# Altium schematic sheet APP_1_DriveMoteur_m.SchDoc
size Tabloid; SheetNumber: 8; SheetTotal: 15; Sheet_Name: DriveMoteur; Size: 11x17
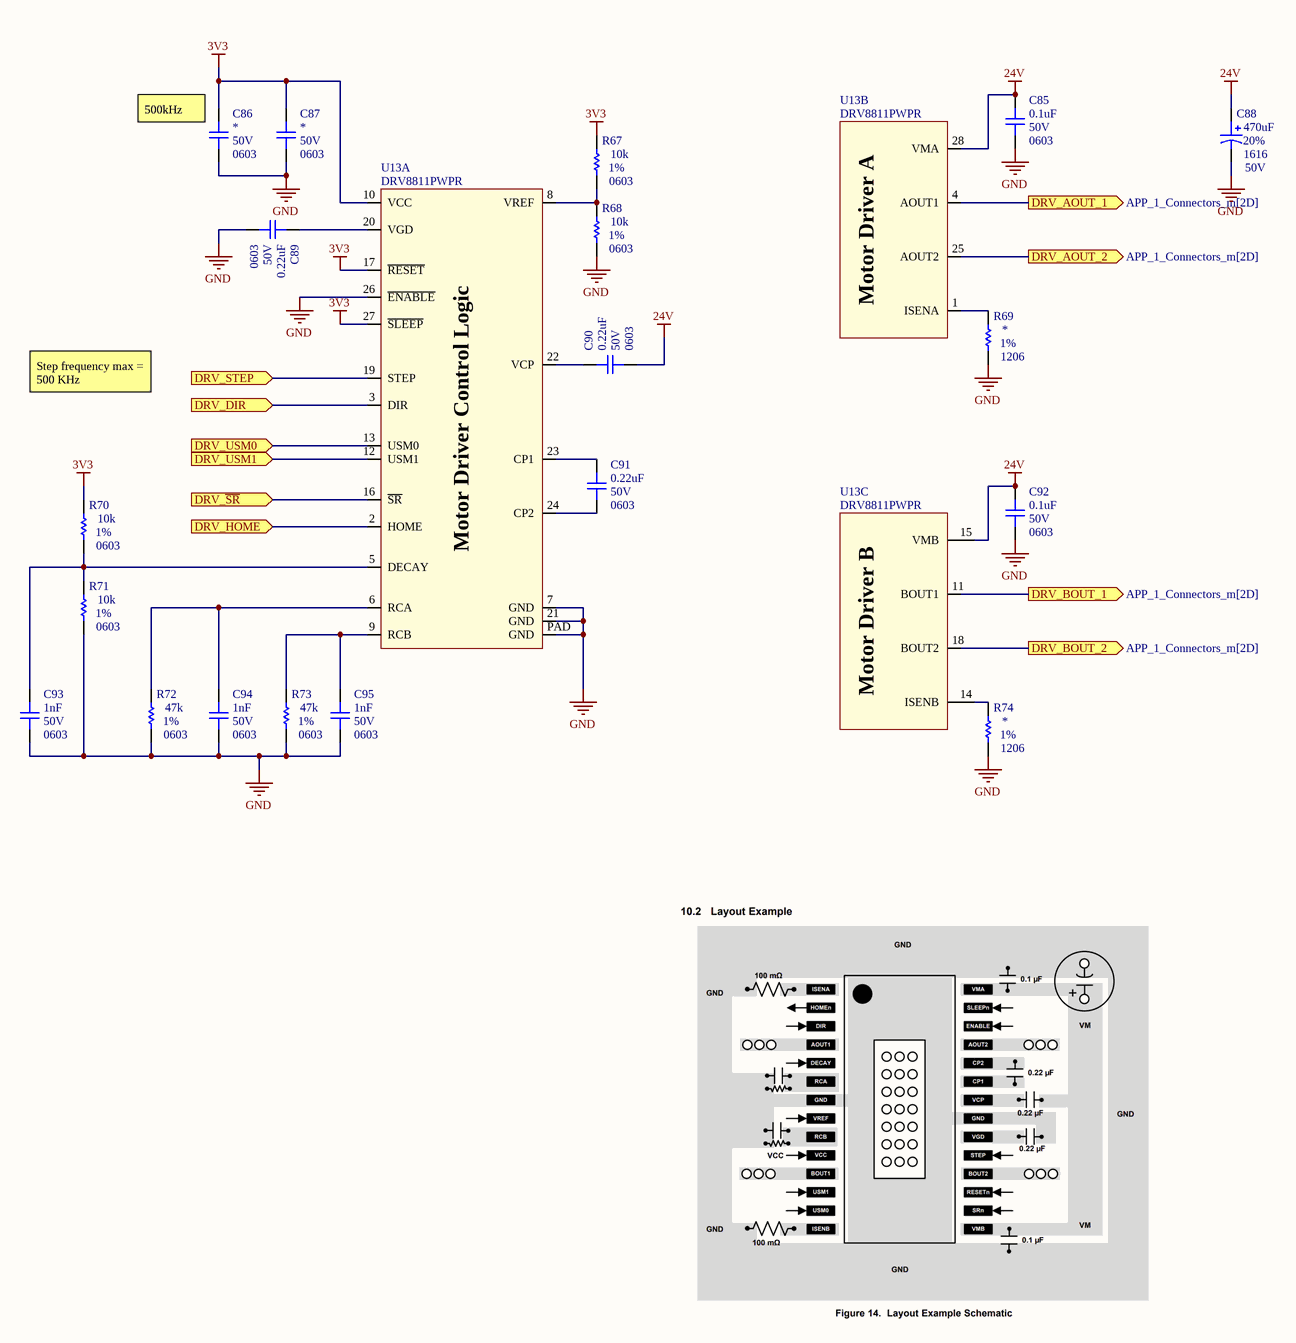
[diagram p0: APP_1_DriveMoteur_m.SchDoc]

## Parts
C85  value 0.1uF  Voltage: 50V  Package: 0603  [CAP_0603]  (hidden comment: CAP - 0603)
C86  Voltage: 50V  Package: 0603  [CAP_0603]  (hidden comment: CAP - 0603)
C87  Voltage: 50V  Package: 0603  [CAP_0603]  (hidden comment: CAP - 0603)
C88  value 470uF  Voltage: 50V  Package: 1616  Precision: 20%  [CAP_ALU_1616_vishay]  (hidden comment: MAL214699108E3)
C89  value 0.22uF  Voltage: 50V  Package: 0603  [CAP_0603]  (hidden comment: CAP - 0603)
C90  value 0.22uF  Voltage: 50V  Package: 0603  [CAP_0603]  (hidden comment: CAP - 0603)
C91  value 0.22uF  Voltage: 50V  Package: 0603  [CAP_0603]  (hidden comment: CAP - 0603)
C92  value 0.1uF  Voltage: 50V  Package: 0603  [CAP_0603]  (hidden comment: CAP - 0603)
C93  value 1nF  Voltage: 50V  Package: 0603  [CAP_0603]  (hidden comment: CAP - 0603)
C94  value 1nF  Voltage: 50V  Package: 0603  [CAP_0603]  (hidden comment: CAP - 0603)
C95  value 1nF  Voltage: 50V  Package: 0603  [CAP_0603]  (hidden comment: CAP - 0603)
R67  value 10k  Package: 0603  Precision: 1%  [RES_0603]  (hidden comment: RES - 0603)
R68  value 10k  Package: 0603  Precision: 1%  [RES_0603]  (hidden comment: RES - 0603)
R69  Package: 1206  Precision: 1%  [RES_1206]  (hidden comment: RES - 1206)
R70  value 10k  Package: 0603  Precision: 1%  [RES_0603]  (hidden comment: RES - 0603)
R71  value 10k  Package: 0603  Precision: 1%  [RES_0603]  (hidden comment: RES - 0603)
R72  value 47k  Package: 0603  Precision: 1%  [RES_0603]  (hidden comment: RES - 0603)
R73  value 47k  Package: 0603  Precision: 1%  [RES_0603]  (hidden comment: RES - 0603)
R74  Package: 1206  Precision: 1%  [RES_1206]  (hidden comment: RES - 1206)
U13  DRV8811PWPR  [POW_MOTOR_DRV8811PWPR]  (parts A,B,C of 3)

## Ports
DRV_AOUT_1 (out, see APP_1_Connectors_m[2D]), DRV_AOUT_2 (out, see APP_1_Connectors_m[2D]), DRV_BOUT_1 (out, see APP_1_Connectors_m[2D]), DRV_BOUT_2 (out, see APP_1_Connectors_m[2D]), DRV_DIR (in), DRV_HOME (in), DRV_STEP (in), DRV_USM0 (in), DRV_USM1 (in), DRV_~{SR} (in)

## Nets
3V3: C86.2 C87.2 R67.2 R70.2 U13.10(VCC) U13.17(~{RESET}) U13.27(~{SLEEP})
24V: C85.2 C88.1 C90.1 C92.2 U13.15(VMB) U13.28(VMA)
GND: C85.1 C86.1 C87.1 C88.2 C89.1 C92.1 C93.1 C94.1 C95.1 R68.1 R69.1 R71.1 R72.1 R73.1 R74.1 U13.7(GND) U13.21(GND) U13.26(~{ENABLE}) U13.PAD(GND)
DRV_AOUT_1: U13.4(AOUT1) ; port DRV_AOUT_1
DRV_AOUT_2: U13.25(AOUT2) ; port DRV_AOUT_2
DRV_BOUT_1: U13.11(BOUT1) ; port DRV_BOUT_1
DRV_BOUT_2: U13.18(BOUT2) ; port DRV_BOUT_2
DRV_DIR: U13.3(DIR) ; port DRV_DIR
DRV_HOME: U13.2(HOME) ; port DRV_HOME
DRV_~{SR}: U13.16(~{SR}) ; port DRV_~{SR}
DRV_STEP: U13.19(STEP) ; port DRV_STEP
DRV_USM0: U13.13(USM0) ; port DRV_USM0
DRV_USM1: U13.12(USM1) ; port DRV_USM1
NetC89_2: C89.2 U13.20(VGD)
NetC90_2: C90.2 U13.22(VCP)
NetC91_1: C91.1 U13.24(CP2)
NetC91_2: C91.2 U13.23(CP1)
NetC93_2: C93.2 R70.1 R71.2 U13.5(DECAY)
NetC94_2: C94.2 R72.2 U13.6(RCA)
NetC95_2: C95.2 R73.2 U13.9(RCB)
NetR67_1: R67.1 R68.2 U13.8(VREF)
NetR69_2: R69.2 U13.1(ISENA)
NetR74_2: R74.2 U13.14(ISENB)

## Notes on the sheet
- (near C86) 500kHz
- Step frequency max = 500 KHz
- Sheet Name
- Project Title
- Global Project
- Size
- Group
- Revision
- Date
- Sheet
- of
- Filename
- Designers
- (in symbol POW_MOTOR_DRV8811PWPR, part A) Motor Driver Control Logic
- (in symbol POW_MOTOR_DRV8811PWPR, part B) Motor Driver A
- (in symbol POW_MOTOR_DRV8811PWPR, part C) Motor Driver B

## Library data of the parts
C85-C87 C89-C95 = CAP - 0603: Precision: 10%; Current: *; CreatedBy: Jonathan Bouchard; Power: *
  C86 C87: Value: *
C88 = CAP_ALU_MAL214699108E3: CAP - ALU 470uF 20% 50V - 1616; Current: 1.3A; Mfg: Vishay Dale; Mfg Part Number: MAL214699108E3; HelpURL: http://www.vishay.com/docs/28403/146cti.pdf; CreatedBy: Jonathan Bouchard; Temperature: -55°C to 125°C; Power: *; Supplier 1: Digikey; Supplier Part Number 1: 4442PHCT-ND
U13 = POW_MOTOR_DRV8811PWPR: POW - STEPPER MOTOR DRIVER - SOP-28; Voltage: 3 V ~ 5.5 V / 8 V ~ 38 V; Mfg: Texas Instrument; Current: *; Power: *; Mfg Part Number: DRV8811PWPR; HelpURL: http://www.ti.com/lit/ds/symlink/drv8811.pdf; CreatedBy: Jonathan Bouchard; Temperature: -40°C ~ 150°C (TJ); Value: *; Precision: *; Package: SOP-28; Supplier 1: Digikey; Supplier Part Number 1: 296-24591-1-ND
R67 R68 R70-R73 = RES - 0603: Current: *; CreatedBy: Jonathan Bouchard
R69 R74 = RES - 1206: Current: *; CreatedBy: Jonathan Bouchard; Value: *